# Altium schematic sheet IsoSupply.SchDoc
size A4; DocumentNumber: 3; SheetNumber: 5; SheetTotal: 15
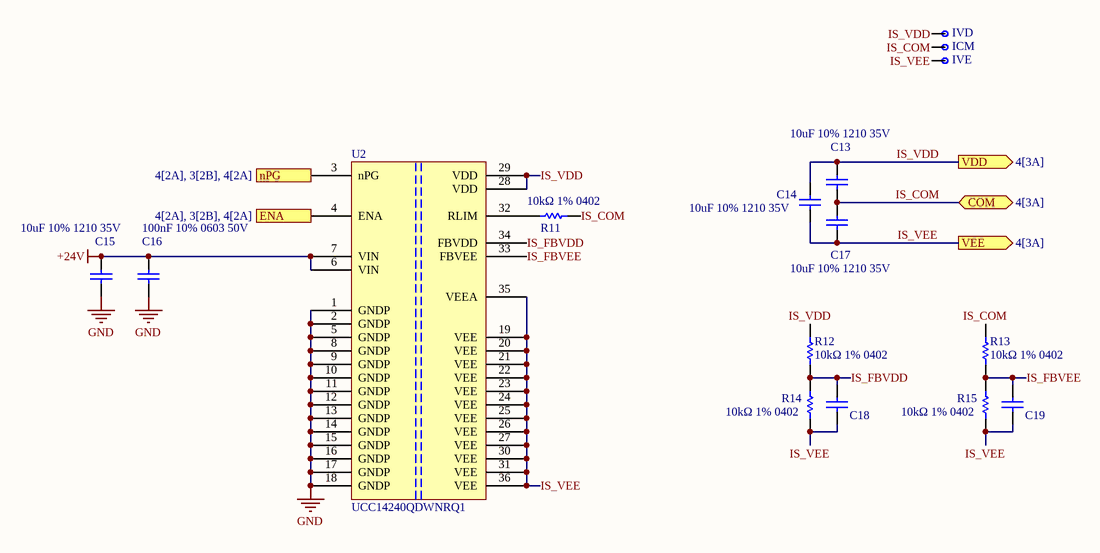
[diagram p0: IsoSupply.SchDoc]

## Parts
C13  10uF 10% 1210 35V  [1210N]
C14  10uF 10% 1210 35V  [1210N]
C15  10uF 10% 1210 35V  [1210N]
C16  100nF 10% 0603 50V  [0603N]
C17  10uF 10% 1210 35V  [1210N]
C18  100nF 10% 0402 25V  [0402N]  (value not drawn)
C19  100nF 10% 0402 25V  [0402N]  (value not drawn)
ICM  Testpoint  [Testpoint-Footprint-1]  (value not drawn)  (no BOM)
IVD  Testpoint  [Testpoint-Footprint-1]  (value not drawn)  (no BOM)
IVE  Testpoint  [Testpoint-Footprint-1]  (value not drawn)  (no BOM)
R11  10kΩ 1% 0402  [0402N]
R12  10kΩ 1% 0402  [0402N]
R13  10kΩ 1% 0402  [0402N]
R14  10kΩ 1% 0402  [0402N]
R15  10kΩ 1% 0402  [0402N]
U2  UCC14240QDWNRQ1  [UCC14240QDWNRQ1-Footprint-1]

## Ports
COM (bidir, see 4[3A]), ENA (in, see 4[2A], 3[2B], 4[2A]), nPG (out, see 4[2A], 3[2B], 4[2A]), VDD (out, see 4[3A]), VEE (out, see 4[3A])

## Nets
+24V: C15.2 C16.2 U2.6(VIN) U2.7(VIN)
GND: C15.1 C16.1 U2.1(GNDP) U2.2(GNDP) U2.5(GNDP) U2.8(GNDP) U2.9(GNDP) U2.10(GNDP) U2.11(GNDP) U2.12(GNDP) U2.13(GNDP) U2.14(GNDP) U2.15(GNDP) U2.16(GNDP) U2.17(GNDP) U2.18(GNDP)
ENA: U2.4(ENA) ; port ENA
IS_COM: C13.1 C17.2 ICM.1 R11.1 R13.1 ; port COM
IS_FBVDD: C18.1 R12.2 R14.2 U2.34(FBVDD)
IS_FBVEE: C19.1 R13.2 R15.2 U2.33(FBVEE)
IS_VDD: C13.2 C14.2 IVD.1 R12.1 U2.28(VDD) U2.29(VDD) ; port VDD
IS_VEE: C14.1 C17.1 C18.2 C19.2 IVE.1 R14.1 R15.1 U2.19(VEE) U2.20(VEE) U2.21(VEE) U2.22(VEE) U2.23(VEE) U2.24(VEE) U2.25(VEE) U2.26(VEE) U2.27(VEE) U2.30(VEE) U2.31(VEE) U2.35(VEEA) U2.36(VEE) ; port VEE
nPG: U2.3(nPG) ; port nPG
NetR11_2: R11.2 U2.32(RLIM)

## Library data of the parts
C13-C15 C17 = C1210: Capacitance: 10u; Tolerance: 10; Voltage: 35; Footprint: 1210
C16 = C0603: Capacitance: 100n; Tolerance: 10; Voltage: 50; Footprint: 0603
C18 C19 = C0402: Capacitance: 100n; Tolerance: 10; Voltage: 25; Footprint: 0402
ICM IVD IVE = CMP-003-000002-1
R11-R15 = R0402: Resistance: 10k; Tolerance: 1; Footprint: 0402
U2 = CMP-019-00063-1: Automotive, 1.5-W, 24-Vin, regulated, 3-kVRMS isolated DC/DC module with integrated transformer</ 36-SO-MOD -40 to 125